# Altium schematic sheet F电源板-V1.SchDoc
size A3
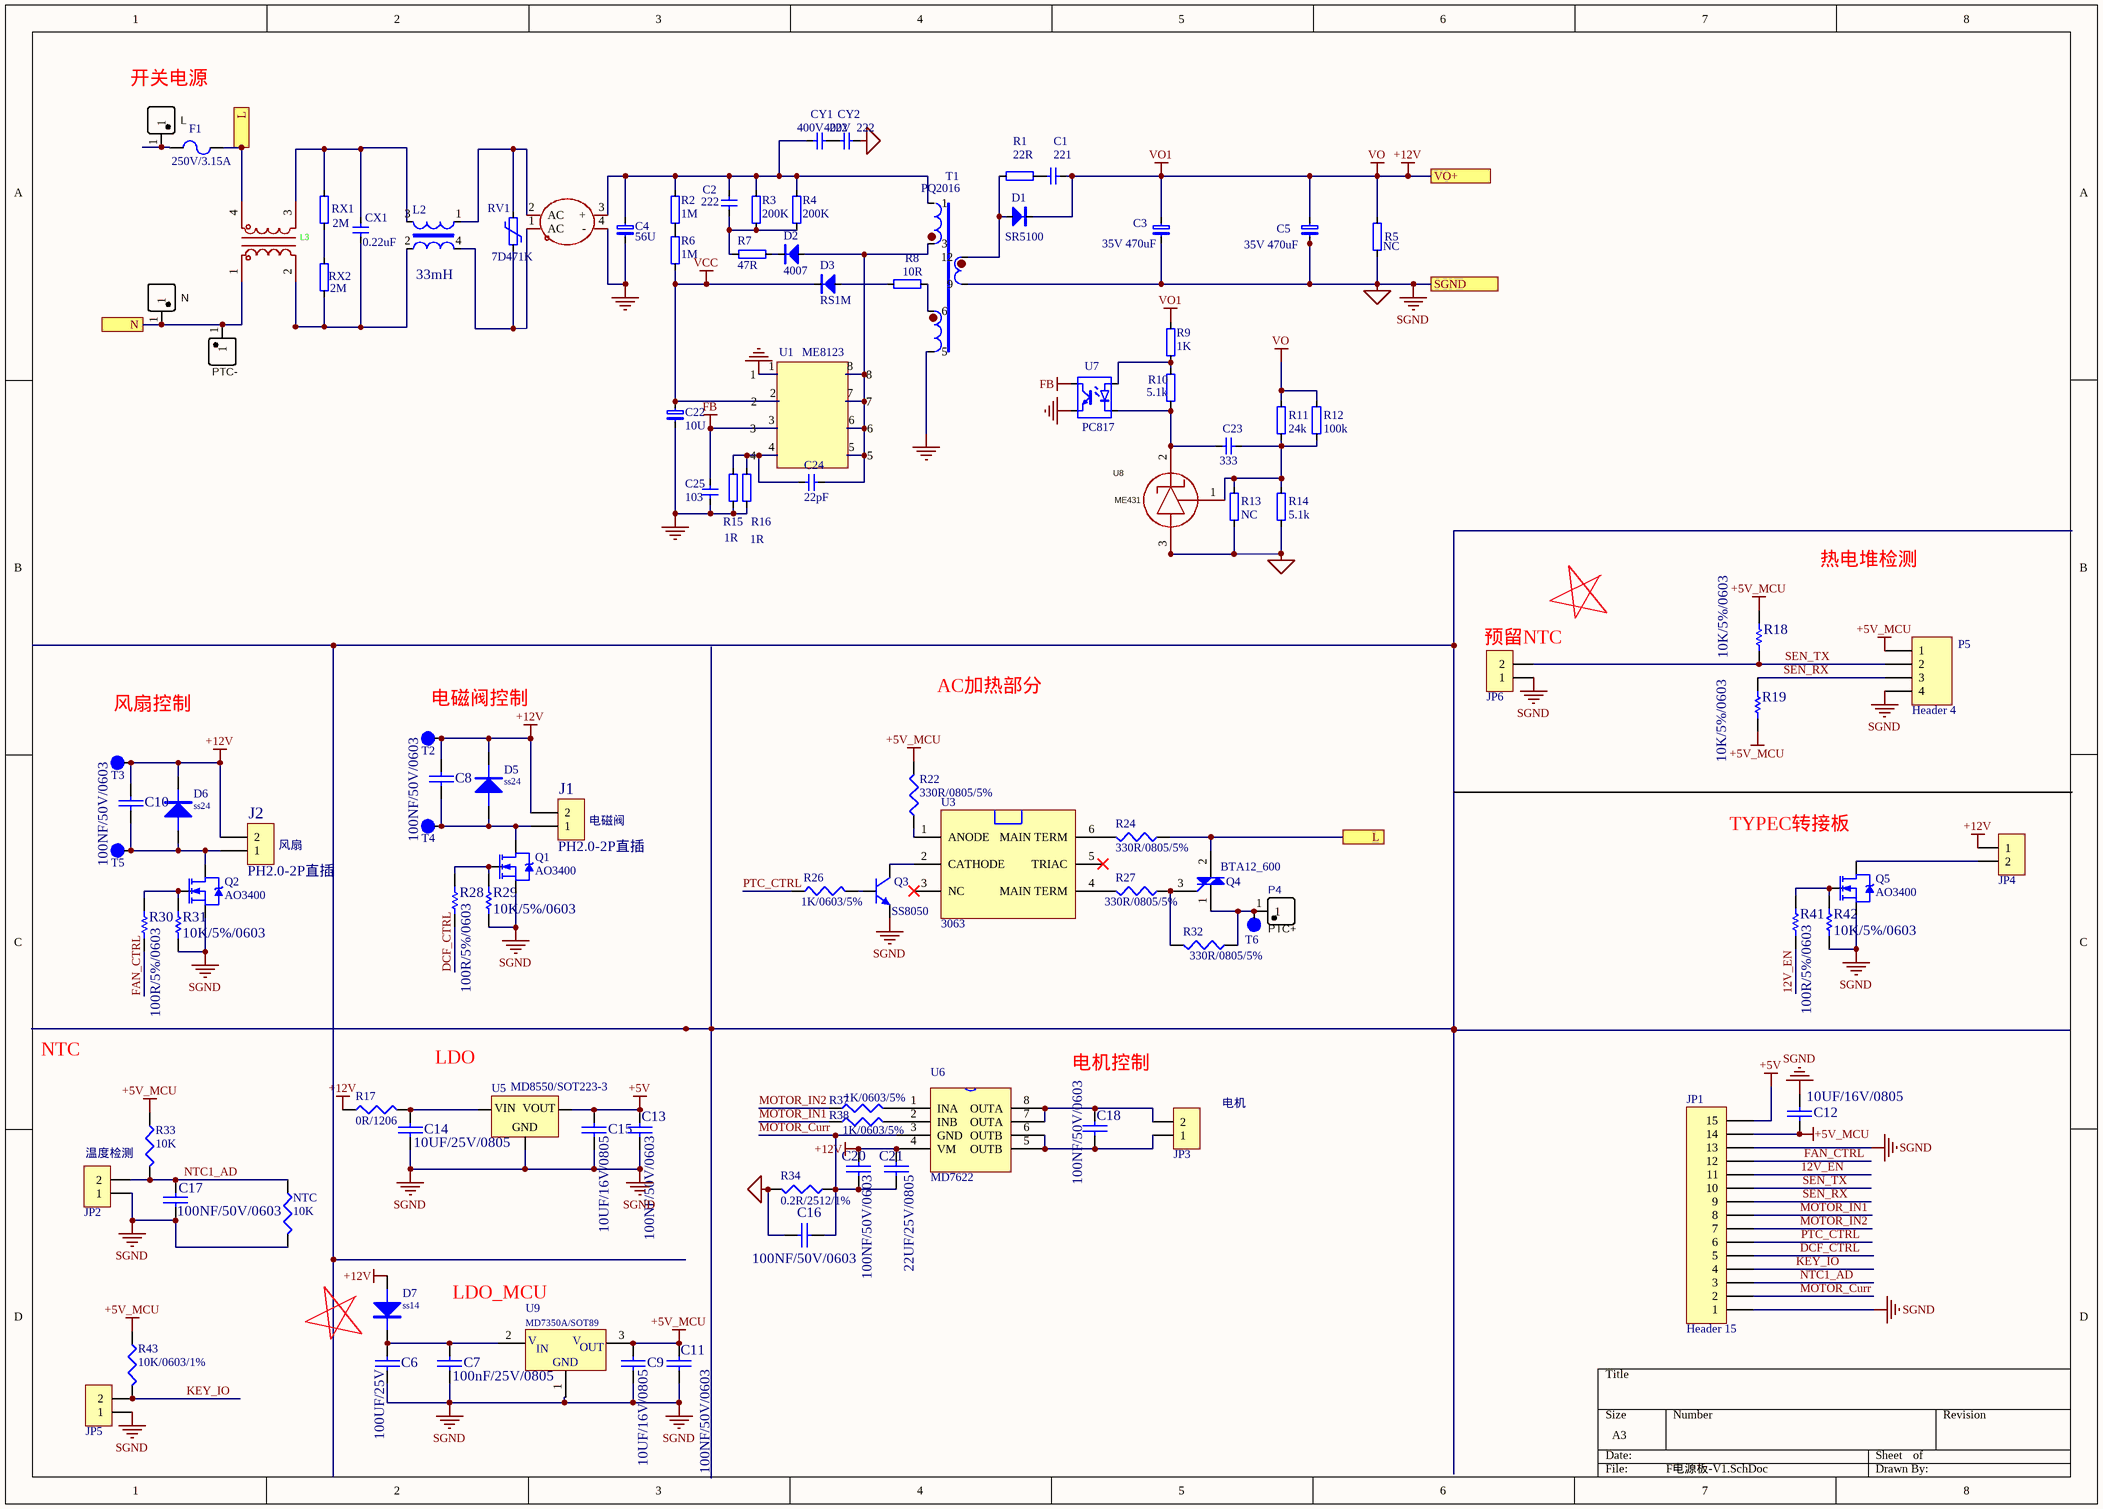
[diagram p0: F电源板-V1.SchDoc]

## Parts
BD1  DB107S  [DBS_L8.4-W6.4-P5.10-LS10.2-BL]  (value not drawn)
C1  221  [1206c]
C2  222  [1206c]
C3  35V 470uF  [CAP 5.0*10*16]
C4  56U  [CAP 7.5*16*25]
C5  35V 470uF  [CAP 5.0*10*16]
C6  100UF/25V  [CAP 2.5*5*11]
C7  100nF/25V/0805  [C 0805_L]
C8  100NF/50V/0603  [C 0603_L]
C9  10UF/16V/0805  [C 0805_L]
C10  100NF/50V/0603  [C 0603_L]
C11  100NF/50V/0603  [C 0603_L]
C12  10UF/16V/0805  [C 0805_L]
C13  100NF/50V/0603  [C 0603_L]
C14  10UF/25V/0805  [C 0805_L]
C15  10UF/16V/0805  [C 0805_L]
C16  100NF/50V/0603  [C 0603_L]
C17  100NF/50V/0603  [C 0603_L]
C18  100NF/50V/0603  [C 0603_L]
C20  100NF/50V/0603  [C 0603_L]
C21  22UF/25V/0805  [0805C-S]
C22  10U  [CAP 2.5*5*11 - BK]
C23  333  [0805C]
C24  22pF  [0805C]
C25  103  [0805C]
CX1  0.22uF  [CAP-TH_L13.0-W6.0-P10.00-D1.2]
CY1  400V  222  [CY2-P10*4.7]
CY2  400V  222  [CY2-P10*4.7]
D1  SR5100  [do-27]
D2  4007  [SMA]
D3  RS1M  [SMA]
D5  ss24  [SOD-123]
D6  ss24  [SOD-123]
D7  ss14  [SOD-123]
F1  250V/3.15A  [MST8*4]
J1  PH2.0-2P直插  [PH2.0-LI-2P]
J2  PH2.0-2P直插  [PH2.0-LI-2P]
JP1  Header 15  [FPC-SMD_15P-P1.00_XUNPU_FPC-1.0FX-15PWCR-H20]
JP2  HDR-1X2  [PH2.0-LI-2P]  (value not drawn)
JP3  HDR-1X2  [PH2.0-LI-2P]  (value not drawn)
JP4  HDR-1X2  [PH2.0-LI-2P]  (value not drawn)
JP5  HDR-1X2  [PH2.0-LI-2P]  (value not drawn)
JP6  HDR-1X2  [PH2.0-LI-2P]  (value not drawn)
L2  (no value)  [UU9.8]
L3  PDMCAT953-501MLN  [IND-TH_4P-L12.0-W6.0_PDMCAT953-501MLN]  (value not drawn)
NTC  10K  [R 0603_L]
P1  L  [4.8*0.8]
P2  N  [4.8*0.8]
P3  PTC-  [4.8*0.8]
P4  PTC+  [4.8*0.8]
P5  Header 4  [FPC-SMD_FPC-0.5-4P-LTH2.0]
Q1  AO3400  [SOT23-3L -big]
Q2  AO3400  [SOT23-3L -big]
Q3  SS8050  [SOT23-3N]
Q4  BTA12_600  [TO-263AB_L10.0-W9.2-P5.08-LS15.4-BL]
Q5  AO3400  [SOT23-3L -big]
R1  22R  [1206r]
R2  1M  [1206R]
R3  200K  [1206R]
R4  200K  [1206R]
R5  NC  [1206R]
R6  1M  [1206R]
R7  47R  [1206R]
R8  10R  [1206]
R9  1K  [0805R]
R10  5.1k  [0805R]
R11  24k  [0805R]
R12  100k  [0805R]
R13  NC  [0805R]
R14  5.1k  [0805R]
R15  1R  [1206R]
R16  1R  [1206R]
R17  0R/1206  [1206r]
R18  10K/5%/0603  [0603R]
R19  10K/5%/0603  [0603R]
R22  330R/0805/5%  [0805R]
R24  330R/0805/5%  [0805R]
R26  1K/0603/5%  [R 0603_L]
R27  330R/0805/5%  [0805R]
R28  100R/5%/0603  [0603R]
R29  10K/5%/0603  [0603R]
R30  100R/5%/0603  [0603R]
R31  10K/5%/0603  [0603R]
R32  330R/0805/5%  [0805R]
R33  10K  [R 0603_L]
R34  0.2R/2512/1%  [R 2512_L]
R37  1K/0603/5%  [R 0603_L]
R38  1K/0603/5%  [R 0603_L]
R41  100R/5%/0603  [0603R]
R42  10K/5%/0603  [0603R]
R43  10K/0603/1%  [R 0603_L]
RV1  7D471K  [VDR 7D-5]
RX1  2M  [1206R]
RX2  2M  [1206R]
T1  PQ2016  [EE1610]
T2  TP  [TP_2.0mm]  (value not drawn)
T3  TP  [TP_2.0mm]  (value not drawn)
T4  TP  [TP_2.0mm]  (value not drawn)
T5  TP  [TP_2.0mm]  (value not drawn)
T6  TP  [TP_2.0mm]  (value not drawn)
U1  ME8123  [DIP8]
U3  3063  [SMD-6_L7.3-W6.5-P2.54-LS10.2-BL]
U5  MD8550/SOT223-3  [SOT-223]
U6  MD7622  [SOP8_N]
U7  PC817  [SMD-4]
U8  ME431  [SOT-23-3_ME431]
U9  MD7350A/SOT89  [SOT89_M]

## Ports
L, N, SGND, VO+

## Nets
+5V: C13.2 C15.1 JP1.15 U5.3(VOUT)
+5V_MCU: C9.1 C11.2 C12.2 JP1.14 P5.1 R18.2 R19.1 R22.2 R33.1 R43.1 U9.3(VIN)
+12V: C1.2 C3.1 C5.1 C8.1 C10.1 C20.2 C21.1 D1.2 D5.2(K) D6.2(K) D7.1(A) J1.2 J2.2 JP4.1 R5.2 R9.2 R11.1 R12.1 R17.1 T2.1 T3.1 U6.4(VM) ; port VO+  [also labelled VO, VO1]
FB: C25.1 U1.3 U7.4
GND: BD1.4(-) C4.2 C22.2 C25.2 R15.1 R16.1 T1.5 U1.1 U7.3
SGND: C3.2 C5.2 C6.2 C7.2 C9.2 C11.1 C12.1 C13.1 C14.2 C15.2 C16.2 C17.2 CY2.2 JP1.1 JP1.13 JP2.1 JP5.1 JP6.1 NTC.2 P5.4 Q1.2(S) Q2.2(S) Q3.2(E) Q5.2(S) R5.1 R13.2 R14.2 R29.1 R31.1 R34.2 R42.1 T1.9 U5.2(GND) U8.3(A) U9.1(GND) ; port SGND
VCC: C22.1 D3.2 R6.2 U1.2
12V_EN: JP1.11 R41.1
DCF_CTRL: JP1.5 R28.1
FAN_CTRL: JP1.12 R30.1
KEY_IO: JP1.4 JP5.2 R43.2
L: F1.1 L3.4 Q4.2(A2) R24.1 ; port L
MOTOR_Curr: C16.1 C20.1 C21.2 JP1.2 R34.1 U6.3(GND)
MOTOR_IN1: JP1.8 R38.1
MOTOR_IN2: JP1.7 R37.1
N: L3.1 P2.1 P3.1 ; port N
NTC1_AD: C17.1 JP1.3 JP2.2 NTC.1 R33.2
PTC_CTRL: JP1.6 R26.1
SEN_RX: JP1.9 P5.3 R19.2
SEN_TX: JP1.10 JP6.2 P5.2 R18.1
NetBD1_1: BD1.1(AC) L2.4 RV1.1
NetBD1_2: BD1.2(AC) L2.1 RV1.2
NetBD1_3: BD1.3(+) C2.2 C4.1 CY1.1 R2.1 R3.1 R4.1 T1.1
NetC1_1: C1.1 R1.2
NetC2_1: C2.1 R3.2 R4.2 R7.2
NetC6_1: C6.1 C7.1 D7.2(K) U9.2(VOUT)
NetC8_2: C8.2 D5.1(A) J1.1 Q1.3(D) T4.1
NetC10_2: C10.2 D6.1(A) J2.1 Q2.3(D) T5.1
NetC14_1: C14.1 R17.2 U5.1(VIN)
NetC18_1: C18.1 JP3.1 U6.5(OUTB) U6.6(OUTB)
NetC18_2: C18.2 JP3.2 U6.7(OUTA) U6.8(OUTA)
NetC23_1: C23.1 R10.1 U7.2 U8.2(C)
NetC23_2: C23.2 R11.2 R12.2 R13.1 R14.1 U8.1(REF)
NetC24_1: C24.1 R15.2 R16.2 U1.4
NetC24_2: C24.2 D2.1 T1.3 U1.5 U1.6 U1.7 U1.8
NetCX1_1: CX1.1 L2.2 L3.2 RX2.1
NetCX1_2: CX1.2 L2.3 L3.3 RX1.2
NetCY1_2: CY1.2 CY2.1
NetD1_1: D1.1 R1.1 T1.12
NetD2_2: D2.2 R7.1
NetD3_1: D3.1 R8.1
NetF1_2: F1.2 P1.1
NetJP4_2: JP4.2 Q5.3(D)
NetP4_1: P4.1 Q4.1(A1) R32.1 T6.1
NetQ1_1: Q1.1(G) R28.2 R29.2
NetQ2_1: Q2.1(G) R30.2 R31.2
NetQ3_1: Q3.1(B) R26.2
NetQ3_3: Q3.3(C) U3.2(CATHODE)
NetQ4_3: Q4.3(G) R27.1 R32.2
NetQ5_1: Q5.1(G) R41.2 R42.2
NetR2_2: R2.2 R6.1
NetR8_2: R8.2 T1.6
NetR9_1: R9.1 R10.2 U7.1
NetR22_1: R22.1 U3.1(ANODE)
NetR24_2: R24.2 U3.6(MAIN_TERM)
NetR27_2: R27.2 U3.4(MAIN_TERM)
NetR37_2: R37.2 U6.1(INA)
NetR38_2: R38.2 U6.2(INB)
NetRX1_1: RX1.1 RX2.2

Not connected (* = marked no-connect by the designer): U3 3(NC)* 5(TRIAC)*

## Notes on the sheet
- 开关电源
- (near L2) 33mH
- 热电堆检测
- (near JP6) 预留NTC
- (near T3) 风扇控制
- (near T2) 电磁阀控制
- AC加热部分
- (near J2) 风扇
- (near J1) 电磁阀
- TYPEC转接板
- NTC
- LDO
- 电机控制
- (near JP3) 电机
- (near JP2) 温度检测
- LDO_MCU
- (in symbol ME6118A_SOT89) V; IN; OUT

## Library data of the parts
BD1 = DB107S_C190797: Manufacturer: Hottech(合科泰); Add into BOM: yes; Voltage - Forward(Vf@If): 1.1V@1A; Voltage - DC Reverse(Vr): 1kV; Current - Rectified: 1A; Reverse Leakage Current (Ir): 10uA@1kV; Peak Forward Surge Current: 50A; Symbol: DB107S_C190797; Device: DB107S_C190797; LCSC Part Name: DB107S; Supplier Part: C190797; Manufacturer Part: DB107S; Supplier Footprint: DBS; JLCPCB Part Class: Extended Part; Datasheet: https://atta.szlcsc.com/upload/public/pdf/source/20220506/F63E10C96512ED5D2BE34C5EF69F07CC.pdf; Supplier: LCSC; Convert to PCB: yes; Operating Temperature: -55℃~+150℃@(Tj)
C1 C2 C23-C25 CX1 CY1 CY2 = C.2: C？
C3-C5 C22 = CB.2: C?
C6-C18 C20 C21 = CAPB
D1-D3 = D.2
D5-D7 = DIODE: PartNo.: *; Footprint.: *; SPC.: *; Group.: *; AVL/EQU.: *; Manufacturer 1.: *; Manufacturer 2.: *; Cost.: *
F1 = FUSE
J1 J2 = CON2: PartNo.: *; Footprint.: *; SPC.: *; Group.: *; AVL/EQU.: *; Manufacturer 1.: *; Manufacturer 2.: *; Cost.: *
JP1 = Header 15: Header, 15-Pin; LatestRevisionDate: 17-Jul-2002; LatestRevisionNote: Re-released for DXP Platform.; Publisher: Altium Limited
JP2-JP6 = Header 2: 2P接插件; 版权归属: 源创客; BOM名称: 2P接插件; 学习资源: www.ooocke.com
L2 = LC.6
L3 = PDMCAT953-501MLN: Manufacturer: PROD(谱罗德); Add into BOM: yes; Number of Lines: 2; Current Rating: 3A; DC Resistance(DCR): 16mΩ; Symbol: PDMCAT953-501MLN; Device: PDMCAT953-501MLN; LCSC Part Name: 两路 插件共模滤波器; Supplier Part: C5158066; Manufacturer Part: PDMCAT953-501MLN; Supplier Footprint: 插件; JLCPCB Part Class: Extended Part; Datasheet: https://atta.szlcsc.com/upload/public/pdf/source/20220914/CD849A92925D682378A854E6D11F1CD4.pdf; Supplier: LCSC; Convert to PCB: yes; Voltage Withstand: -; Inductance @ Frequency: -; Voltage Rating - DC: -; Impedance @ Frequency: -; Operating Temperature: -
NTC R17 R22 R24 R26 R27 R32-R34 R37 R38 R43 = R
P1-P4 = BAT: BOM_Manufacturer: null; BOM_Manufacturer Part: TP-红色测试点; Contributor: lcsc; BOM_Supplier: LCSC; BOM_Supplier Part: C9900007423; link: https://atta.szlcsc.comnull; BOM_JLCPCB Part Class: Extended Part; spicePre: U; spiceSymbolName: TP-红色测试点
P5 = Header 4: Header, 4-Pin; LatestRevisionDate: 17-Jul-2002; LatestRevisionNote: Re-released for DXP Platform.; Publisher: Altium Limited
Q1 Q2 Q5 = NMOS-2: N-Channel Power MOSFET; Note: Pin 2 is electrically connected to pin 4.; Published: 8-Jun-2000; LatestRevisionDate: 17-Jul-2002; LatestRevisionNote: Re-released for DXP Platform.; DatasheetDocument: PD-9.814; PackageReference: TO-220AB; Publisher: Altium Limited; Code_JEDEC: TO-220-AB; ComponentLink1Description: Manufacturer Link; ComponentLink1URL: http://www.irf.com/
Q3 = 8050-SMD: 高频放大-NPN型; 版权归属: 源创客; 属性: 40V 1.5A 1W 100MHZ; BOM名称: 高频放大-NPN型; 学习资源: www.ooocke.com
Q4 = BTA12_600: 双向可控硅; 版权归属: 源创客; BOM名称: 双向可控硅; 学习资源: www.ooocke.com
R1-R16 RX1 RX2 = R.2
R18 R19 R28-R31 R41 R42 = RESA: SPC.: 5%; Footprint.: R0603; Group.: *; AVL/EQU.: *; Manufacturer 1.: *; Manufacturer 2.: *; Cost.: *
RV1 = RM
T1 = T.6
U1 = 8603
U3 = MOC3021
U5 = AMS1117-3.3V
U6 = 013a_1
U7 = OP
U8 = ME431AXG: Manufacturer: MICRONE(南京微盟); Add into BOM: yes; Output Type: 可调; Output Voltage: 2.5V~36V; Output Current: 100mA; Minimum Cathode Current for Regulation: 1mA; Symbol: ME431AXG; Device: ME431AXG; LCSC Part Name: ME431AXG; Supplier Part: C85795; Manufacturer Part: ME431AXG; Supplier Footprint: SOT-23; JLCPCB Part Class: Extended Part; Datasheet: https://atta.szlcsc.com/upload/public/pdf/source/20161114/1479092091701.pdf; Supplier: LCSC; Convert to PCB: yes; Operating Temperature: -40℃~+150℃@(TA); Comment_1: ME431AXG
U9 = ME6118A_SOT89